# EAGLE schematic ir_remote (EAGLE 7.2.0)
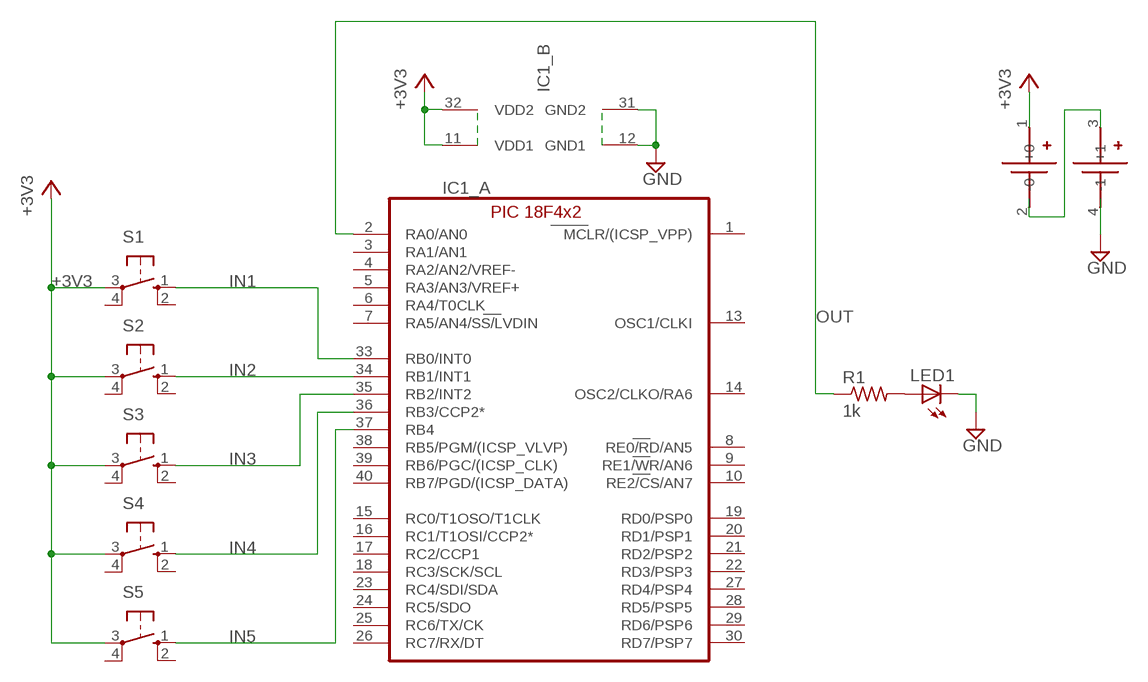
[diagram p0: schematic, sheet 1]

## Parts
IC1  PIC18F4X2DIL40  [DIL40]
LED1  LED5MM  [LED5MM]
R1  1k  R-US_0207/12  [0207/12]
S1  10-XX  [B3F-10XX]
S2  10-XX  [B3F-10XX]
S3  10-XX  [B3F-10XX]
S4  10-XX  [B3F-10XX]
S5  10-XX  [B3F-10XX]
U$1  BLOSSOM-BLM-18650-2PCS  [BLOSSOM-BLM-18650-2PCS]

## Nets
+3V3: IC1.11(_B:VDD1) IC1.32(_B:VDD2) S1.3(P) S2.3(P) S3.3(P) S4.3(P) S5.3(P) U$1.1(+0)
GND: IC1.12(_B:GND1) IC1.31(_B:GND2) LED1.K(C)
IN1: IC1.33(_A:RB0/INT0) S1.1(S)
IN2: IC1.34(_A:RB1/INT1) S2.1(S)
IN3: IC1.35(_A:RB2/INT2) S3.1(S)
IN4: IC1.36(_A:RB3/CCP2*) S4.1(S)
IN5: IC1.37(_A:RB4) S5.1(S)
N$1: LED1.A R1.2
N$7: U$1.3(+1)
OUT: IC1.2(_A:RA0/AN0) R1.1
Unconnected: IC1.3(_A:RA1/AN1) IC1.4(_A:RA2/AN2/VREF-) IC1.5(_A:RA3/AN3/VREF+) IC1.6(_A:RA4/T0CLK) IC1.7(_A:RA5/AN4/SS/LVDIN) IC1.8(_A:RE0/RD/AN5) IC1.9(_A:RE1/WR/AN6) IC1.10(_A:RE2/CS/AN7) IC1.15(_A:RC0/T1OSO/T1CLK) IC1.16(_A:RC1/T1OSI/CCP2*) IC1.17(_A:RC2/CCP1) IC1.18(_A:RC3/SCK/SCL) IC1.19(_A:RD0/PSP0) IC1.20(_A:RD1/PSP1) IC1.21(_A:RD2/PSP2) IC1.22(_A:RD3/PSP3) IC1.23(_A:RC4/SDI/SDA) IC1.24(_A:RC5/SDO) IC1.25(_A:RC6/TX/CK) IC1.26(_A:RC7/RX/DT) IC1.27(_A:RD4/PSP4) IC1.28(_A:RD5/PSP5) IC1.29(_A:RD6/PSP6) IC1.30(_A:RD7/PSP7) IC1.38(_A:RB5/PGM/(ICSP_VLVP)) IC1.39(_A:RB6/PGC/(ICSP_CLK)) IC1.40(_A:RB7/PGD/(ICSP_DATA)) S1.2(S1) S1.4(P1) S2.2(S1) S2.4(P1) S3.2(S1) S3.4(P1) S4.2(S1) S4.4(P1) S5.2(S1) S5.4(P1) U$1.2(-0) U$1.4(-1)

## Power pins joined to a net without a drawn wire
MCLR/(ICSP_VPP): IC1.1(_A:MCLR/(ICSP_VPP))
OSC1/CLKI: IC1.13(_A:OSC1/CLKI)
OSC2/CLKO/RA6: IC1.14(_A:OSC2/CLKO/RA6)

## Library data of the parts
IC1 = pic18f4x2:PIC18F4X2: Pic Microcontroller
LED1 = led:LED: LED OSRAM: - CHIPLED LG R971, LG N971, LY N971, LG Q971, LY Q971, LO R971, LY R971 LH N974, LH R974 LS Q976, LO Q976, LY Q976 LO Q996 - Hyper CHIPLED LW Q18S LB Q993, LB Q99A, LB R99A - SideLED LS A670, LO A670, LY A670, LG A670, LP A670 LB A673, LV A673, LT A673, LW A673 LH A674 LY A675 LS A676, LA A676, LO A676, LY A676, LW A676 LS A679, LY A679, LG A679 - Hyper Micro SIDELED® LS Y876, LA Y876, LO Y876, LY Y876 LT Y87S - SmartLED LW L88C, LW L88S LB L89C, LB L89S, LG L890 LS L89K, LO L89K, LY L89K LS L896, LA L896, LO L896, LY L896 - TOPLED LS T670, LO T670, LY T670, LG T670, LP T670 LSG T670, LSP T670, LSY T670, LOP T670, LYG T670 LG T671, LOG T671, LSG T671 LB T673, LV T673, LT T673, LW T673 LH T674 LS T676, LA T676, LO T676, LY T676, LB T676, LH T676, LSB T676, LW T676 LB T67C, LV T67C, LT T67C, LS T67K, LO T67K, LY T67K, LW E67C LS E67B, LA E67B, LO E67B, LY E67B, LB E67C, LV E67C, LT E67C LW T67C LS T679, LY T679, LG T679 LS T770, LO T770, LY T770, LG T770, LP T770 LB T773, LV T773, LT T773, LW T773 LH T774 LS E675, LA E675, LY E675, LS T675 LS T776, LA T776, LO T776, LY T776, LB T776 LHGB T686 LT T68C, LB T68C - Hyper Mini TOPLED® LB M676 - Mini TOPLED Santana® LG M470 LS M47K, LO M47K, LY M47K Source: http://www.osram.convergy.de LUXEON: - LUMILED® LXK2-PW12-R00, LXK2-PW12-S00, LXK2-PW14-U00, LXK2-PW14-V00 LXK2-PM12-R00, LXK2-PM12-S00, LXK2-PM14-U00 LXK2-PE12-Q00, LXK2-PE12-R00, LXK2-PE12-S00, LXK2-PE14-T00, LXK2-PE14-U00 LXK2-PB12-K00, LXK2-PB12-L00, LXK2-PB12-M00, LXK2-PB14-N00, LXK2-PB14-P00, LXK2-PB14-Q00 LXK2-PR12-L00, LXK2-PR12-M00, LXK2-PR14-Q00, LXK2-PR14-R00 LXK2-PD12-Q00, LXK2-PD12-R00, LXK2-PD12-S00 LXK2-PH12-R00, LXK2-PH12-S00 LXK2-PL12-P00, LXK2-PL12-Q00, LXK2-PL12-R00 Source: www.luxeon.com KINGBRIGHT: KA-3528ASYC Source: www.kingbright.com
R1 = resistor:R-US_: RESISTOR, American symbol
S1-S5 = switch-omron:10-XX: OMRON SWITCH; MPN: B3F-1000; OC_FARNELL: 176432; OC_NEWARK: 36M3542
U$1 = battery-holders:BLOSSOM-BLM-18650-2PCS